# Altium project line_tracking_mouse.PrjPcb
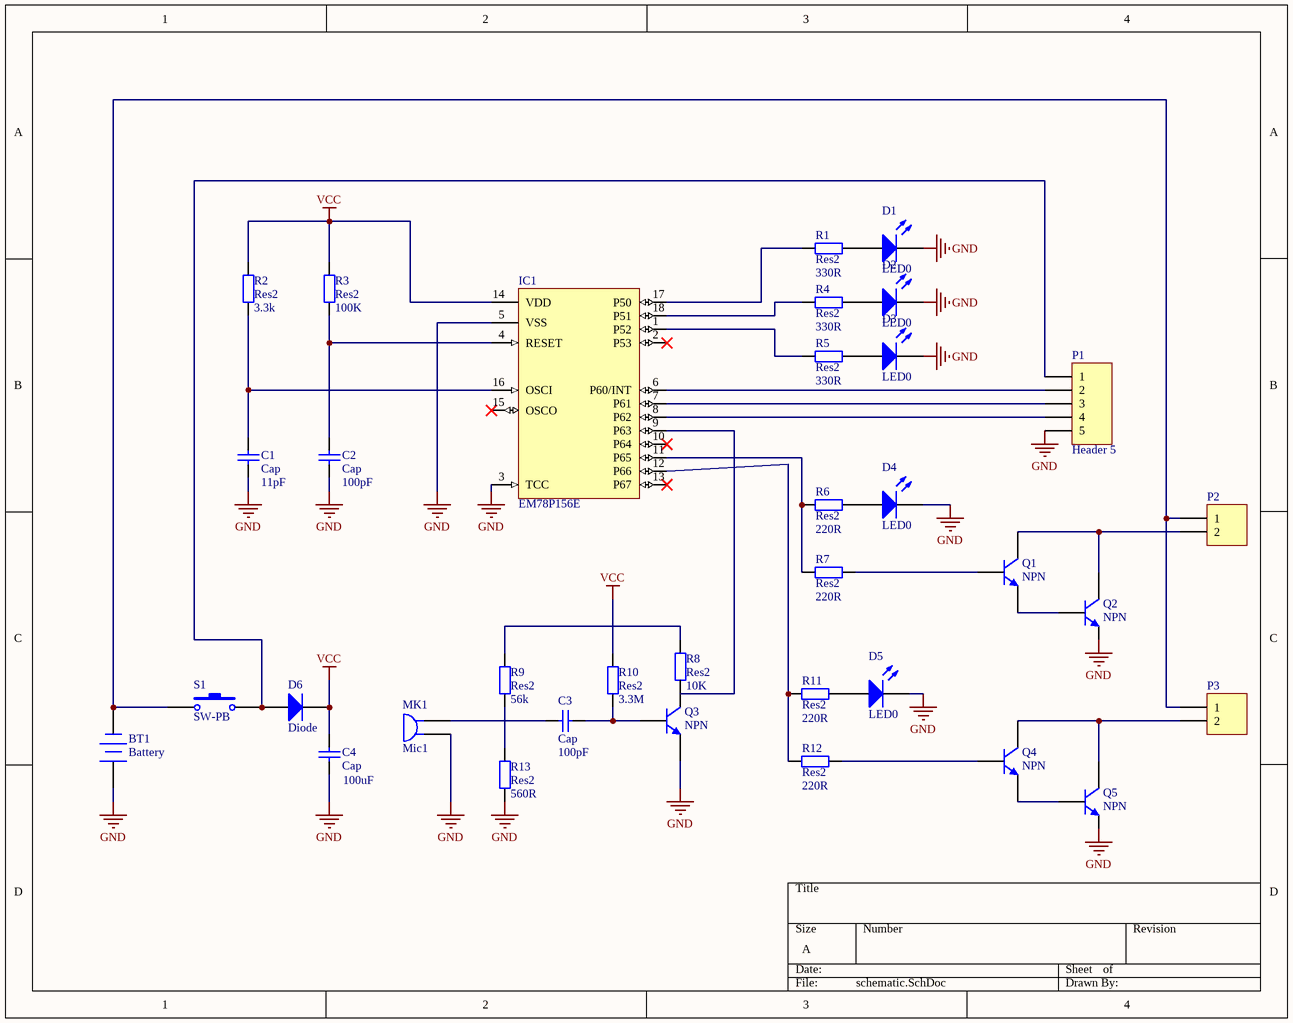
[diagram p0: schematic.SchDoc]
1 sheet, 35 parts. Net scope: global (net labels, ports and power ports of the same name join across sheets).

## Sheet schematic.SchDoc: Line Tracking Mouse
size A

### Parts
BT1  Battery  [BAT-2]
C1  Cap  value 11pF  [RAD-0.3]
C2  Cap  value 100pF  [RAD-0.3]
C3  Cap  value 100pF  [RAD-0.3]
C4  Cap  value 100uF  [RAD-0.3]
D1  LED0  [LED-0]
D2  LED0  [LED-0]
D3  LED0  [LED-0]
D4  LED0  [LED-0]
D5  LED0  [LED-0]
D6  Diode  [SMC]
IC1  EM78P156E  [DIP18]
MK1  Mic1  [PIN2]
P1  Header 5  [HDR1X5]
P2  Header 2  [HDR1X2]  (value not drawn)
P3  Header 2  [HDR1X2]  (value not drawn)
Q1  NPN  [TO-226-AA]
Q2  NPN  [TO-226-AA]
Q3  NPN  [TO-226-AA]
Q4  NPN  [TO-226-AA]
Q5  NPN  [TO-226-AA]
R1  Res2  value 330R  [AXIAL-0.4]
R2  Res2  value 3.3k  [AXIAL-0.4]
R3  Res2  value 100K  [AXIAL-0.4]
R4  Res2  value 330R  [AXIAL-0.4]
R5  Res2  value 330R  [AXIAL-0.4]
R6  Res2  value 220R  [AXIAL-0.4]
R7  Res2  value 220R  [AXIAL-0.4]
R8  Res2  value 10K  [AXIAL-0.4]
R9  Res2  value 56k  [AXIAL-0.4]
R10  Res2  value 3.3M  [AXIAL-0.4]
R11  Res2  value 220R  [AXIAL-0.4]
R12  Res2  value 220R  [AXIAL-0.4]
R13  Res2  value 560R  [AXIAL-0.4]
S1  SW-PB  [SPST-2]

### Nets
GND: BT1.1(+) C1.1 C2.1 C4.1 D1.2(K) D2.2(K) D3.2(K) D4.2(K) D5.2(K) IC1.3(TCC) IC1.5(VSS) MK1.1 P1.5 Q3.3(E) R13.1
VCC: C4.2 D6.2(K) IC1.14(VDD) R2.2 R3.2 R10.2
NetBT1_2: BT1.2(-) P2.1 P3.1 S1.1
NetC1_2: C1.2 IC1.16(OSCI) R2.1
NetC2_2: C2.2 IC1.4(RESET) R3.1
NetC3_1: C3.1 Q3.2(B) R10.1
NetC3_2: C3.2 MK1.2
NetD1_1: D1.1(A) R1.1
NetD2_1: D2.1(A) R4.1
NetD3_1: D3.1(A) R5.1
NetD4_1: D4.1(A) R6.1
NetD5_1: D5.1(A) R11.1
NetD6_1: D6.1(A) P1.1 S1.2
NetIC1_1: IC1.1(P52) R5.2
NetIC1_6: IC1.6(P60/INT) P1.2
NetIC1_7: IC1.7(P61) P1.3
NetIC1_8: IC1.8(P62) P1.4
NetIC1_9: IC1.9(P63) R8.1
NetIC1_11: IC1.11(P65) R6.2 R7.2
NetIC1_12: IC1.12(P66) R11.2 R12.2
NetIC1_17: IC1.17(P50) R1.2
NetIC1_18: IC1.18(P51) R4.2
NetP2_2: P2.2 Q1.1(C) Q2.1(C)
NetP3_2: P3.2 Q4.1(C) Q5.1(C)
NetQ1_2: Q1.2(B) R7.1
NetQ1_3: Q1.3(E) Q2.2(B)
NetQ4_2: Q4.2(B) R12.1
NetQ4_3: Q4.3(E) Q5.2(B)
NetR8_2: R8.2 R9.2
NetR9_1: R9.1 R13.2

Not connected (* = marked no-connect by the designer): IC1 2(P53)* 10(P64)* 13(P67)* 15(OSCO)*; Q2 3(E); Q3 1(C); Q5 3(E)

### Notes on the sheet
- Labels drawn without touching a wire or pin: GND

### Library data of the parts
BT1 = Battery: Multicell Battery; Published: 24-Mar-1999; LatestRevisionDate: 17-Jul-2002; LatestRevisionNote: Re-released for DXP Platform.; PackageReference: BAT-2; Publisher: Altium Limited; PackageDescription: Battery; 2 Leads
C1-C4 = Cap: Capacitor; Published: 8-Jun-2000; LatestRevisionDate: 17-Jul-2002; LatestRevisionNote: Re-released for DXP Platform.; PackageReference: RAD-0.3; Publisher: Altium Limited; PackageDescription: Radial Cap, Thru-Hole; 2 Leads; 0.3 in Pin Spacing
D1-D5 = LED0: Typical INFRARED GaAs LED; Published: 8-Jun-2000; LatestRevisionDate: 08-Jul-2005; LatestRevisionNote: Mech Layer 1 removed.; PackageReference: LED-0; Publisher: Altium Limited; PackageDescription: LED; 2 Leads
D6 = Diode: Default Diode; Published: 8-Jun-2000; LatestRevisionDate: 17-Jul-2002; LatestRevisionNote: Re-released for DXP Platform.; PackageVersion: Sep-1996; PackageReference: SMC; Publisher: Altium Limited; PackageDescription: DO-214-AB/SMC; 2 C-Bend Leads; Body 7.9 x 5.9 mm, inc. leads (LxW); Code_JEDEC: DO-214-AB
MK1 = Mic1: Microphone; Published: 24-Mar-1999; LatestRevisionDate: 17-Jul-2002; LatestRevisionNote: Re-released for DXP Platform.; PackageReference: PIN2; Publisher: Altium Limited
P1 = Header 5: Header, 5-Pin; LatestRevisionDate: 17-Jul-2002; LatestRevisionNote: Re-released for DXP Platform.; Publisher: Altium Limited
P2 P3 = Header 2: Header, 2-Pin; LatestRevisionDate: 17-Jul-2002; LatestRevisionNote: Re-released for DXP Platform.; Publisher: Altium Limited
Q1-Q5 = NPN: NPN Bipolar Transistor; Published: 8-Jun-2000; LatestRevisionDate: 17-Jul-2002; LatestRevisionNote: Re-released for DXP Platform.; PackageReference: TO-226-AA; Publisher: Altium Limited; PackageDescription: TO, Flat Index; 3 In-Line, Axial Leads; Body Dia. 4.8mm; Leads 0.55 x 0.51 mm (max); Code_JEDEC: TO-226-AA
R1-R13 = Res2: Resistor; Published: 8-Jun-2000; LatestRevisionDate: 17-Jul-2002; LatestRevisionNote: Re-released for DXP Platform.; PackageReference: AXIAL-0.4; Publisher: Altium Limited; PackageDescription: Axial Device, Thru-Hole; 2 Leads; 0.4 in Pin Spacing
S1 = SW-PB: Switch; Published: 24-Mar-1999; LatestRevisionDate: 17-Jul-2002; LatestRevisionNote: Re-released for DXP Platform.; PackageReference: SPST-2; Publisher: Altium Limited; PackageDescription: Switch; 2 Leads